# Altium schematic sheet 24V-5V.SchDoc
size A4
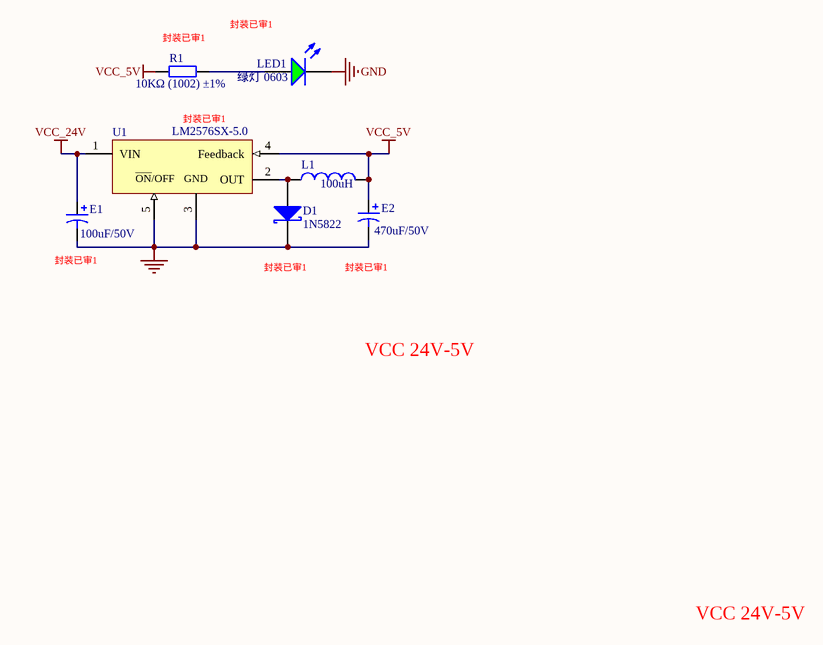
[diagram p0: 24V-5V.SchDoc]

## Parts
D1  1N5822  [DO214_SMA]
E1  value 100uF/50V  [CAP_PR_3.5_8]  (hidden comment: Cap Pol1)
E2  value 470uF/50V  [CAP_PR_5.0_13]  (hidden comment: Cap Pol1)
L1  100uH  [Inductor_CDRH127R]
LED1  绿灯 0603  [LED_0603_G]
R1  10KΩ (1002) ±1%  [RESC_0603_2]
U1  LM2576SX-5.0  [TO263_5]

## Nets
GND: D1.2(K) E1.2 E2.2 LED1.K U1.3(DGND) U1.5(ON/OFF)
VCC_5V: E2.1 L1.2 U1.4(Feedback)
VCC_24V: E1.1 U1.1(VIN)
NetD1_1: D1.1(A) L1.1 U1.2(OUT)
NetLED1_A: LED1.A R1.2

Not connected (* = marked no-connect by the designer): R1 1

## Notes on the sheet
- (near R1) 封装已审1
- 封装已审1
- (near E1) 封装已审1
- (near D1) 封装已审1
- (near E2) 封装已审1
- VCC 24V-5V
- Labels drawn without touching a wire or pin: VCC_5V
- (in symbol LM2576SX-5.0_[C34465]) ___; GND

## Library data of the parts
D1 = SMA(DO-214AC) 1N5822: 整流二极管; ComponentLink1Description: 供应商链接; ComponentLink1URL: http://www.szlcsc.com/product/details_2841.html; Package: SMA(DO-214AC)
E1 E2 = Cap Pol1: Polarized Capacitor (Radial); Published: 8-Jun-2000; LatestRevisionDate: 17-Jul-2002; LatestRevisionNote: Re-released for DXP Platform.; PackageReference: RB7.6-15; Publisher: Altium Limited
L1 = Inductor: Code_IEC: 1005; Published: 8-Jun-2000; LatestRevisionDate: 29-May-2009; LatestRevisionNote: IPC-7351 Footprint Added.; PackageReference: 0402-A; Publisher: Altium Limited; PackageDescription: Chip Inductor; Code_JEITA: 0402; Value: 100uH
LED1 = 0603 绿灯: 发光二极管; ComponentLink1Description: 供应商链接; ComponentLink1URL: http://www.szlcsc.com/product/details_73152.html; Package: 0603; Supplier: LC; SuppliersPartNumber: C72043
R1 = 0603 10KΩ (1002) 1%: 贴片电阻; ComponentLink1Description: 供应商链接; ComponentLink1URL: http://www.szlcsc.com/product/details_26547.html; Package: 0603; Supplier: LC; SuppliersPartNumber: C25804
U1 = LM2576SX-5.0_[C34465]: DC-DC芯片; ComponentLink1Description: 供应商链接; ComponentLink1URL: http://www.szlcsc.com/product/details_35434.html; Package: TO-263-5; Supplier: LC; SuppliersPartNumber: C34465